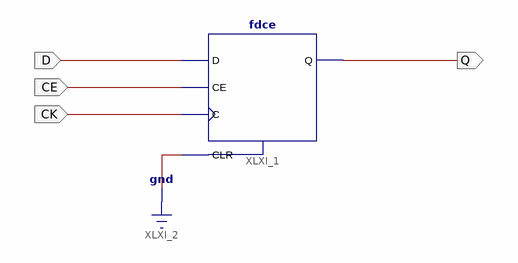
[diagram p0: schematic sheet 1]
// Xilinx ISE schematic fd1e.sch (Spartan2E) as structural Verilog: 1 symbols, 4 ports
module fd1e (
  input  CE,
  input  CK,
  input  D,
  output Q
);

  fdce XLXI_1 (.C(CK), .CE(CE), .CLR(1'b0), .D(D), .Q(Q));
endmodule
